# EAGLE design WatsonV1 (EAGLE 9.3.1)
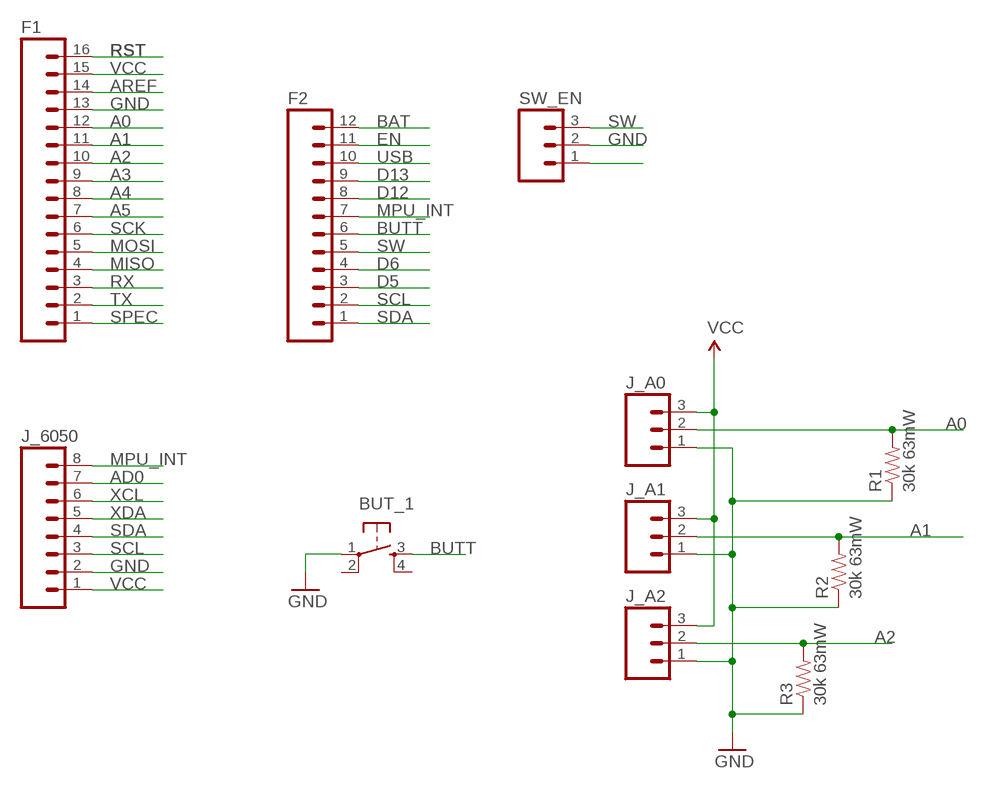
[diagram p0: schematic, sheet 1]

## Parts
BUT_1  TAC_SWITCHPTH  [TACTILE-PTH]
F1  M16PTH  [1X16]
F2  M12PTH  [1X12]
J_6050  M08  [1X08_ROUND]
J_A0  M03JST-PTH-VERT  [JST-3-PTH-VERT]
J_A1  M03JST-PTH-VERT  [JST-3-PTH-VERT]
J_A2  M03JST-PTH-VERT  [JST-3-PTH-VERT]
R1  30k 63mW  RESISTOR1206  [1206]
R2  30k 63mW  RESISTOR1206  [1206]
R3  30k 63mW  RESISTOR1206  [1206]
SW_EN  M03PTH  [1X03]

## Nets
A0: F1.12 J_A0.2 R1.2
A1: F1.11 J_A1.2 R2.2
A2: F1.10 J_A2.2 R3.2
A3: F1.9
A4: F1.8
A5: F1.7
AD0: J_6050.7
AREF: F1.14
BAT: F2.12
BUTT: BUT_1.3 F2.6
D5: F2.3
D6: F2.4
D12: F2.8
D13: F2.9
EN: F2.11
GND: BUT_1.1 F1.13 J_6050.2 J_A0.1 J_A1.1 J_A2.1 R1.1 R2.1 R3.1 SW_EN.2
MISO: F1.4
MOSI: F1.5
MPU_INT: F2.7 J_6050.8
N$3: SW_EN.1
RST: F1.16
RX: F1.3
SCK: F1.6
SCL: F2.2 J_6050.3
SDA: F2.1 J_6050.4
SPEC: F1.1
SW: F2.5 SW_EN.3
TX: F1.2
USB: F2.10
VCC: F1.15 J_6050.1 J_A0.3 J_A1.3 J_A2.3
XCL: J_6050.6
XDA: J_6050.5
Unconnected: BUT_1.2 BUT_1.4

## Library data of the parts
BUT_1 = SparkFun-Retired:TAC_SWITCH: Momentary Switch Button commonly used for reset or general input. Spark Fun Electronics SKU : COM-00097 SMT- SWCH-08247
F1 = SparkFun-Connectors:M16: 1x16 .1" header
F2 = SparkFun-Connectors:M12: Header 12 Standard 12-pin 0.1" header. Use with straight break away headers (SKU : PRT-00116), right angle break away headers (PRT-00553), swiss pins (PRT-00743), machine pins (PRT-00117), and female headers (PRT-00115).
J_6050 = SparkFun-Connectors:M08: Header 8 Standard 8-pin 0.1" header. Use with straight break away headers (SKU : PRT-00116), right angle break away headers (PRT-00553), swiss pins (PRT-00743), machine pins (PRT-00117), and female headers (PRT-00115).; PROD_ID: CONN-08437
J_A0 J_A1 J_A2 SW_EN = SparkFun-Connectors:M03: Header 3 Standard 3-pin 0.1" header. Use with straight break away headers (SKU : PRT-00116), right angle break away headers (PRT-00553), swiss pins (PRT-00743), machine pins (PRT-00117), and female headers (PRT-00115). Molex polarized connector foot print use with SKU : PRT-08232 with associated crimp pins and housings.
R1-R3 = SparkFun-Resistors:RESISTOR: Resistor Basic schematic elements and footprints for 0603, 1206, and PTH resistors.

## Board
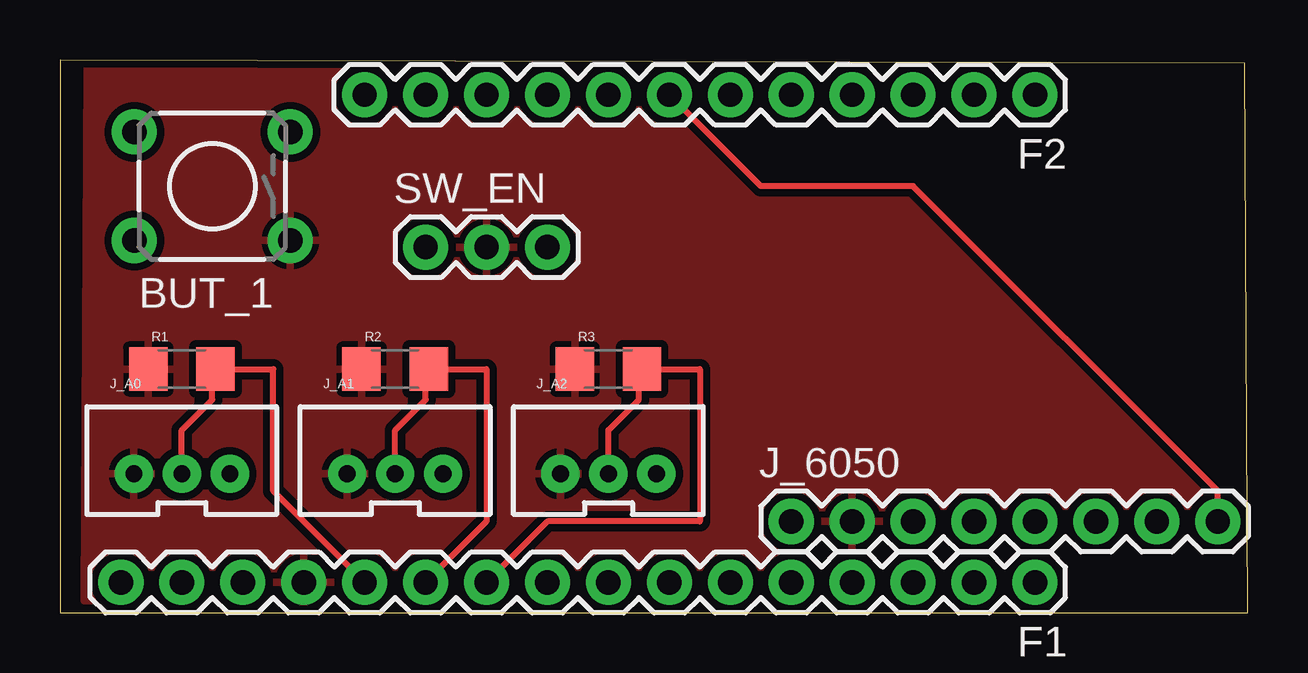
[diagram p1: board, top side]
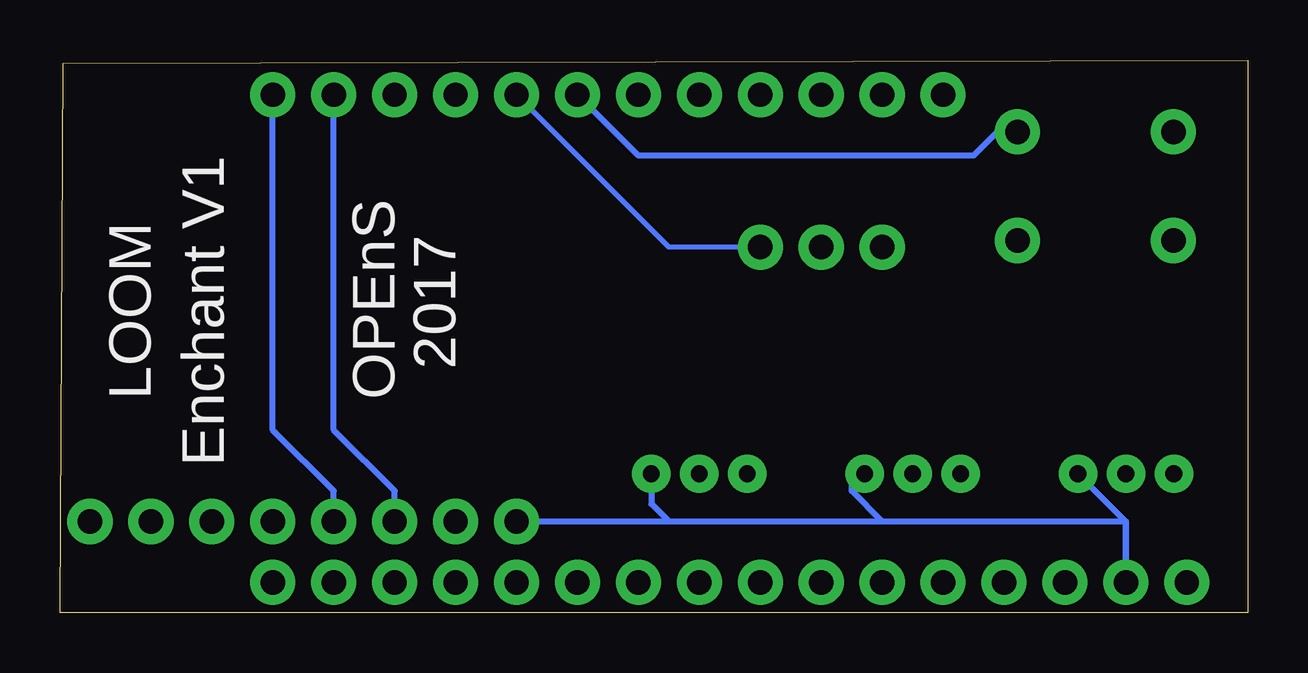
[diagram p2: board, bottom side, seen from below]

Size 49.51 x 23.04 mm. Coordinates in mm from the lower left corner, seen from the top.
Outline: 0,0 49.51,0 49.38,22.91 0,23.04 0,0
Copper layers (1*16): Top 0.035mm / dielectric 1.5mm / Bottom 0.035mm
Design rules "SparkFun": minimum track width 8mil, minimum drill 20mil, track to track 8mil, track to pad 8mil, pad to pad 8mil, via to via 8mil, smd to smd 8mil, copper to edge 8mil, drill to drill 8mil, minimum pad ring 12mil, minimum via ring 10mil, stop-mask expansion 4mil, vias tented up to drill 20mil, thermal gap 10mil

### Footprints (pad centres in the part's own frame; a part is rotated, then mirrored left to right if it is on the bottom)
TACTILE-PTH = drill 1.016 pad 1.88: 1 -3.251,2.261; 2 3.251,2.261; 3 -3.251,-2.261; 4 3.251,-2.261
1X16 = drill 1.016 pad 1.88: 1 0,0; 2 2.54,0; 3 5.08,0; 4 7.62,0; 5 10.16,0; 6 12.7,0; 7 15.24,0; 8 17.78,0; 9 20.32,0; 10 22.86,0; 11 25.4,0; 12 27.94,0; 13 30.48,0; 14 33.02,0; 15 35.56,0; 16 38.1,0
1X12 = drill 1.016 pad 1.88: 1 0,0; 2 2.54,0; 3 5.08,0; 4 7.62,0; 5 10.16,0; 6 12.7,0; 7 15.24,0; 8 17.78,0; 9 20.32,0; 10 22.86,0; 11 25.4,0; 12 27.94,0
1X08_ROUND = drill 1.016 pad 1.88: 1 0,0; 2 2.54,0; 3 5.08,0; 4 7.62,0; 5 10.16,0; 6 12.7,0; 7 15.24,0; 8 17.78,0
JST-3-PTH-VERT = drill 0.7 pad 1.6: 1 -2,-0.55; 2 0,-0.55; 3 2,-0.55
1206 = smd 1.6 x 1.8: 1 -1.4,0; 2 1.4,0
1X03 = drill 1.016 pad 1.88: 1 0,0; 2 2.54,0; 3 5.08,0

### Placement (x,y rotation side)
BUT_1  6.35,17.78 180 top
F1  40.64,1.27 180 top
F2  40.64,21.59 180 top
J_6050  30.48,3.81 0 top
J_A0  5.08,6.35 0 top
J_A1  13.97,6.35 0 top
J_A2  22.86,6.35 0 top
R1  5.08,10.16 0 top
R2  13.97,10.16 0 top
R3  22.86,10.16 0 top
SW_EN  15.24,15.24 0 top

### Tracks (layer width: path | path; a pad name or v marks a point on that pad's centre or on a via)
A0
  Top 0.254: F1.12 8.89,5.08 8.89,10.16 R1.2 6.35,10.03 6.35,8.89 5.08,7.62 J_A0.2
A1
  Top 0.254: J_A1.2 13.97,7.62 15.24,8.89 15.24,10.03 R2.2 17.78,10.16 17.78,3.81 F1.11
A2
  Top 0.254: J_A2.2 22.86,7.62 24.13,8.89 24.13,10.03 R3.2 26.67,10.16 26.67,3.81 20.32,3.81 F1.10
BUTT
  Bottom 0.254: BUT_1.3 9.88,20.04 10.16,20.32 11.43,19.05 25.4,19.05 F2.6
GND
  pour Top (isolate 0.305): 1.14,22.86 1.02,0.51 49.53,0 49.53,22.86
MPU_INT
  Top 0.254: J_6050.8 48.26,5.08 35.56,17.78 29.21,17.78 F2.7
SCL
  Bottom 0.254: J_6050.3 35.56,5.08 38.1,7.62 F2.2
SDA
  Bottom 0.254: J_6050.4 38.1,5.08 40.64,7.62 F2.1
SW
  Bottom 0.203: SW_EN.3 24.13,15.24 F2.5
VCC
  Bottom 0.254: J_A0.3 5.08,3.8 F1.15 5.08,3.81 15.24,3.81 | 15.24,3.81 16.51,5.08 16.51,5.26 J_A1.3 | J_A2.3 24.86,4.54 24.13,3.81 | 24.13,3.81 15.24,3.81 | J_6050.1 24.13,3.81

### Text on the board
bPlace: Enchant V1 | 2017 | OPEnS | LOOM